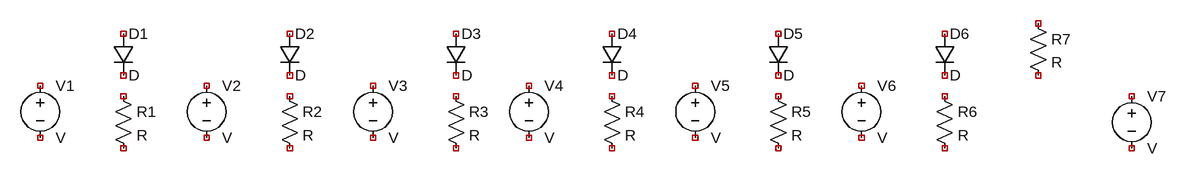
[diagram p0: schematic Draft2.asc]
Draft2.asc, the LTspice schematic file:
Version 4
SHEET 1 1400 680
SYMBOL voltage -336 128 R0
SYMATTR InstName V1
SYMBOL res -224 144 R0
SYMATTR InstName R1
SYMBOL diode -224 64 R0
SYMATTR InstName D1
SYMBOL voltage -80 128 R0
SYMATTR InstName V2
SYMBOL res 32 144 R0
SYMATTR InstName R2
SYMBOL diode 32 64 R0
SYMATTR InstName D2
SYMBOL voltage 176 128 R0
SYMATTR InstName V3
SYMBOL res 288 144 R0
SYMATTR InstName R3
SYMBOL diode 288 64 R0
SYMATTR InstName D3
SYMBOL voltage 416 128 R0
SYMATTR InstName V4
SYMBOL res 528 144 R0
SYMATTR InstName R4
SYMBOL diode 528 64 R0
SYMATTR InstName D4
SYMBOL voltage 672 128 R0
SYMATTR InstName V5
SYMBOL res 784 144 R0
SYMATTR InstName R5
SYMBOL diode 784 64 R0
SYMATTR InstName D5
SYMBOL voltage 928 128 R0
SYMATTR InstName V6
SYMBOL res 1040 144 R0
SYMATTR InstName R6
SYMBOL diode 1040 64 R0
SYMATTR InstName D6
SYMBOL voltage 1344 144 R0
SYMATTR InstName V7
SYMBOL res 1184 32 R0
SYMATTR InstName R7

The netlist it stands for:
* Draft2.asc
V1 NC_01 NC_02 V
R1 NC_03 NC_04 R
D1 NC_05 NC_06 D
V2 NC_07 NC_08 V
R2 NC_09 NC_10 R
D2 NC_11 NC_12 D
V3 NC_13 NC_14 V
R3 NC_15 NC_16 R
D3 NC_17 NC_18 D
V4 NC_19 NC_20 V
R4 NC_21 NC_22 R
D4 NC_23 NC_24 D
V5 NC_25 NC_26 V
R5 NC_27 NC_28 R
D5 NC_29 NC_30 D
V6 NC_31 NC_32 V
R6 NC_33 NC_34 R
D6 NC_35 NC_36 D
V7 NC_37 NC_38 V
R7 NC_39 NC_40 R
.model D D
.lib standard.dio
.backanno
.end